# EAGLE schematic xerc2 (EAGLE 7.5.0)
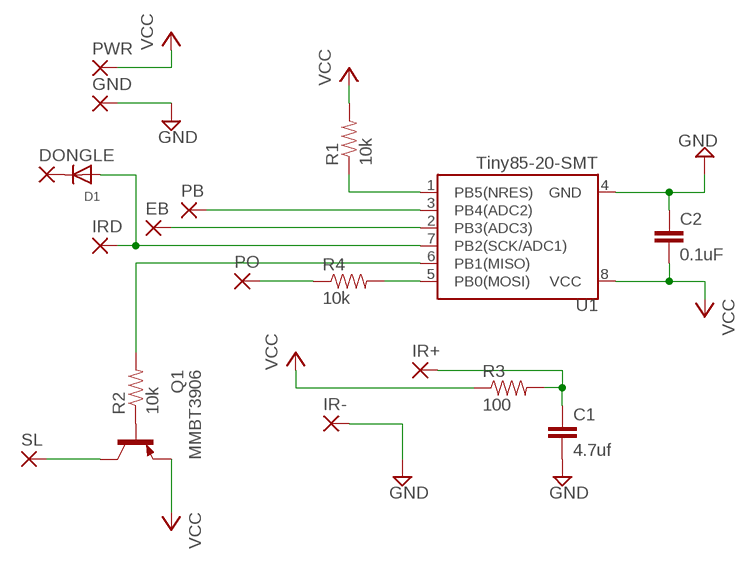
[diagram p0: schematic, sheet 1]

## Parts
C1  4.7uf  CAP0603-CAP  [0603-CAP]
C2  0.1uF  0.1UF-25V(+80/-20%)(0603)  [0603-CAP]
D1  DIODESOD-323F  [SOD-323F]
DONGLE  SMD5  [SMD2,54-5,08]
EB  SMD5  [SMD2,54-5,08]
GND  SMD5  [SMD2,54-5,08]
IR+  SMD5  [SMD2,54-5,08]
IR-  SMD5  [SMD2,54-5,08]
IRD  SMD5  [SMD2,54-5,08]
MMBT3906  Q1  MMBTA56-SOT23  [SOT23]
PB  SMD5  [SMD2,54-5,08]
PO  SMD5  [SMD2,54-5,08]
PWR  SMD5  [SMD2,54-5,08]
R1  10k  RESISTOR0603  [0603-RES]
R2  10k  RESISTOR0603-RES  [0603-RES]
R3  100  RESISTOR0603  [0603-RES]
R4  10k  RESISTOR0603-RES  [0603-RES]
SL  SMD5  [SMD2,54-5,08]
U1  Tiny85-20-SMT  ATTINY45TINY85-20-SMT  [SO08-EIAJ]

## Nets
GND: C1.2 C2.1 GND.1(P) IR-.1(P) U1.4(GND)
N$1: PB.1(P) U1.3(PB4(ADC2))
N$2: R1.1 U1.1(PB5(NRES))
N$3: EB.1(P) U1.2(PB3(ADC3))
N$4: D1.A IRD.1(P) U1.7(PB2(SCK/ADC1))
N$5: R2.2 U1.6(PB1(MISO))
N$6: MMBT3906.1(B) R2.1
N$7: MMBT3906.3(C) SL.1(P)
N$8: C1.1 IR+.1(P) R3.2
N$9: R4.2 U1.5(PB0(MOSI))
N$10: PO.1(P) R4.1
N$11: D1.C DONGLE.1(P)
VCC: C2.2 MMBT3906.2(E) PWR.1(P) R1.2 R3.1 U1.8(VCC)

## Library data of the parts
C1 = SparkFun-Capacitors:CAP: Capacitor Standard 0603 ceramic capacitor, and 0.1" leaded capacitor.
C2 = SparkFun-Capacitors:0.1UF-25V(+80/-20%)(0603): CAP-00810 Ceramic Standard decoupling cap; PROD_ID: CAP-00810
D1 = adafruit:DIODE: Diode SMADIODE - SMA Surface Mount Package 20V 1A Schottky Diode Digikey: 641-1014-6-ND DO-1N4148 - Through Hole Small Current Diode SOD-123 20V 1 A (.5mV Vf) Schottky Diode - Digikey: MBRX120TPMSCT-ND SOD-323 10V 570mA (.38mV Vf, 3ns) Schottky Diode - Digikey: ZLLS410CT-ND SOD-523 30V 30mA Schottky Diode (RB751S-40TE61) - Digikey: RB751S-40TE61CT-ND SOT23-R/W - SOT23 Package (R = Solder Paste/Reflow Ovens, W = Hand-Soldering) BAT54Film 40V 300mA - Digikey: 497-7162-1-ND
DONGLE EB GND IR+ IR- IRD PB PO PWR SL = wirepad:SMD5: SMD PAD
MMBT3906 = transistor-pnp:*-?: PNP Transistor
R1 R3 = SparkFun-Resistors:RESISTOR: Resistor Basic schematic elements and footprints for 0603, 1206, and PTH resistors.
R2 R4 = SparkFun-Passives:RESISTOR: Resistor Basic schematic elements and footprints for 0603, 1206, and PTH resistors.
U1 = SparkFun-DigitalIC:ATTINY45: Atmel 8-pin 2/4/8kB flash uC; PROD_ID: IC-09092